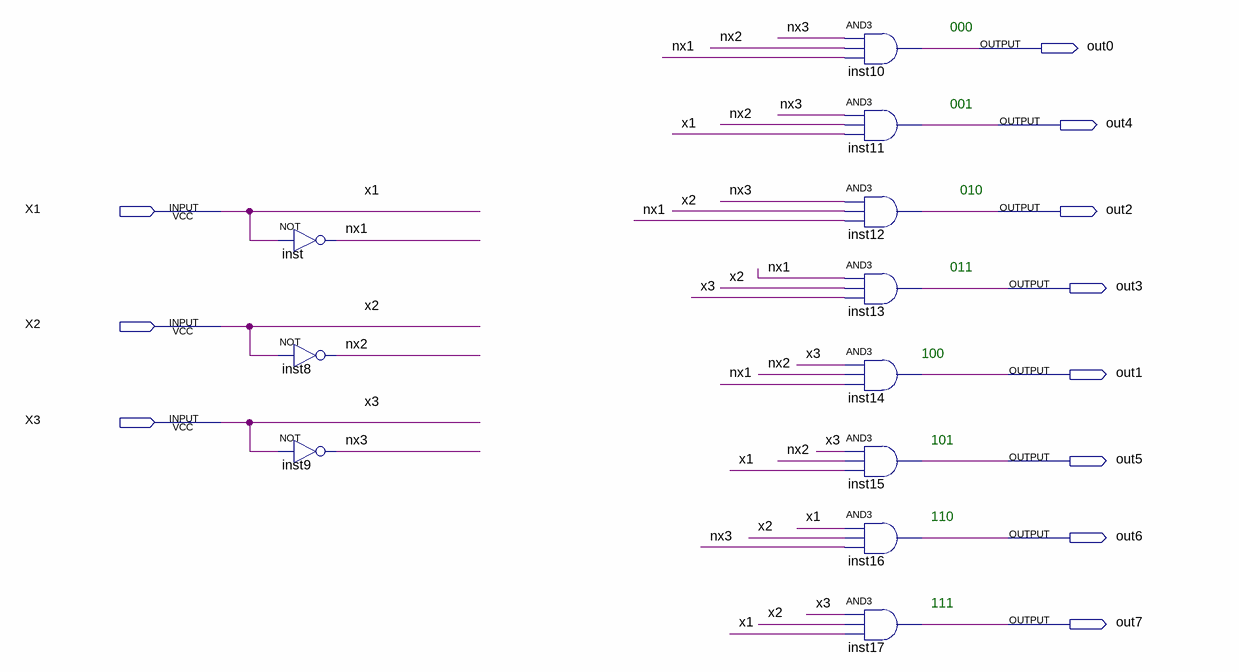
[diagram p0: schematic sheet]
// Quartus schematic decoder3x8.bdf as structural Verilog: 11 symbols, 11 pins
module decoder3x8 (
  input  X1,
  input  X2,
  input  X3,
  output out0,
  output out4,
  output out2,
  output out3,
  output out1,
  output out5,
  output out6,
  output out7
);

  wire nx1, nx2, nx3;

  not inst (nx1, X1);
  not inst8 (nx2, X2);
  not inst9 (nx3, X3);
  and inst10 (out0, nx3, nx2, nx1);
  and inst11 (out4, nx3, nx2, X1);
  and inst12 (out2, nx3, X2, nx1);
  and inst13 (out3, nx1, X2, X3);
  and inst14 (out1, X3, nx2, nx1);
  and inst15 (out5, X3, nx2, X1);
  and inst16 (out6, X1, X2, nx3);
  and inst17 (out7, X3, X2, X1);

  // Notes on the sheet:
  //   000
  //   001
  //   010
  //   011
  //   100
  //   101
  //   110
  //   111
endmodule
